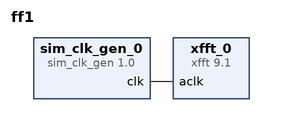
[diagram p0: block diagram of the top level]
# Vivado block design ff1, xc7z007sclg400-1, Vivado 2023.1
create_bd_design ff1

create_bd_cell -type ip -vlnv xilinx.com:ip:xfft:9.1 xfft_0
create_bd_cell -type ip -vlnv xilinx.com:ip:sim_clk_gen:1.0 sim_clk_gen_0

# ---- connections ----

connect_bd_net [get_bd_pins sim_clk_gen_0/clk] [get_bd_pins xfft_0/aclk]

validate_bd_design
save_bd_design
